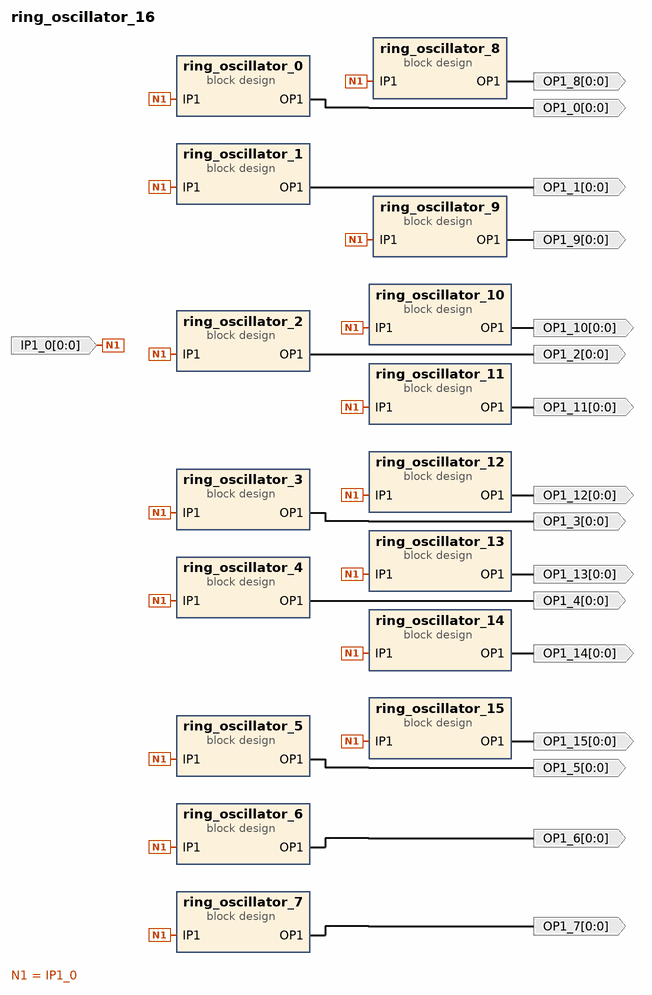
[diagram p0: block diagram of the top level]
# Vivado block design ring_oscillator_16, xc7z020clg400-1, Vivado 2021.1
create_bd_design ring_oscillator_16

create_bd_port -dir I -from 0 -to 0 IP1_0
create_bd_port -dir O -from 0 -to 0 OP1_0
create_bd_port -dir O -from 0 -to 0 OP1_1
create_bd_port -dir O -from 0 -to 0 OP1_2
create_bd_port -dir O -from 0 -to 0 OP1_3
create_bd_port -dir O -from 0 -to 0 OP1_4
create_bd_port -dir O -from 0 -to 0 OP1_5
create_bd_port -dir O -from 0 -to 0 OP1_6
create_bd_port -dir O -from 0 -to 0 OP1_7
create_bd_port -dir O -from 0 -to 0 OP1_8
create_bd_port -dir O -from 0 -to 0 OP1_9
create_bd_port -dir O -from 0 -to 0 OP1_10
create_bd_port -dir O -from 0 -to 0 OP1_11
create_bd_port -dir O -from 0 -to 0 OP1_12
create_bd_port -dir O -from 0 -to 0 OP1_13
create_bd_port -dir O -from 0 -to 0 OP1_14
create_bd_port -dir O -from 0 -to 0 OP1_15

create_bd_cell -type container -reference ring_oscillator ring_oscillator_0
set_property -dict [list \
  CONFIG.ACTIVE_SIM_BD ring_oscillator.bd \
  CONFIG.ACTIVE_SYNTH_BD ring_oscillator.bd \
  CONFIG.ENABLE_DFX 0 \
  CONFIG.LIST_SIM_BD ring_oscillator.bd \
  CONFIG.LIST_SYNTH_BD ring_oscillator.bd \
  CONFIG.LOCK_PROPAGATE 0 \
] [get_bd_cells ring_oscillator_0]
create_bd_cell -type container -reference ring_oscillator ring_oscillator_1
set_property -dict [list \
  CONFIG.ACTIVE_SIM_BD ring_oscillator.bd \
  CONFIG.ACTIVE_SYNTH_BD ring_oscillator.bd \
  CONFIG.ENABLE_DFX 0 \
  CONFIG.LIST_SIM_BD ring_oscillator.bd \
  CONFIG.LIST_SYNTH_BD ring_oscillator.bd \
  CONFIG.LOCK_PROPAGATE 0 \
] [get_bd_cells ring_oscillator_1]
create_bd_cell -type container -reference ring_oscillator ring_oscillator_2
set_property -dict [list \
  CONFIG.ACTIVE_SIM_BD ring_oscillator.bd \
  CONFIG.ACTIVE_SYNTH_BD ring_oscillator.bd \
  CONFIG.ENABLE_DFX 0 \
  CONFIG.LIST_SIM_BD ring_oscillator.bd \
  CONFIG.LIST_SYNTH_BD ring_oscillator.bd \
  CONFIG.LOCK_PROPAGATE 0 \
] [get_bd_cells ring_oscillator_2]
create_bd_cell -type container -reference ring_oscillator ring_oscillator_3
set_property -dict [list \
  CONFIG.ACTIVE_SIM_BD ring_oscillator.bd \
  CONFIG.ACTIVE_SYNTH_BD ring_oscillator.bd \
  CONFIG.ENABLE_DFX 0 \
  CONFIG.LIST_SIM_BD ring_oscillator.bd \
  CONFIG.LIST_SYNTH_BD ring_oscillator.bd \
  CONFIG.LOCK_PROPAGATE 0 \
] [get_bd_cells ring_oscillator_3]
create_bd_cell -type container -reference ring_oscillator ring_oscillator_4
set_property -dict [list \
  CONFIG.ACTIVE_SIM_BD ring_oscillator.bd \
  CONFIG.ACTIVE_SYNTH_BD ring_oscillator.bd \
  CONFIG.ENABLE_DFX 0 \
  CONFIG.LIST_SIM_BD ring_oscillator.bd \
  CONFIG.LIST_SYNTH_BD ring_oscillator.bd \
  CONFIG.LOCK_PROPAGATE 0 \
] [get_bd_cells ring_oscillator_4]
create_bd_cell -type container -reference ring_oscillator ring_oscillator_5
set_property -dict [list \
  CONFIG.ACTIVE_SIM_BD ring_oscillator.bd \
  CONFIG.ACTIVE_SYNTH_BD ring_oscillator.bd \
  CONFIG.ENABLE_DFX 0 \
  CONFIG.LIST_SIM_BD ring_oscillator.bd \
  CONFIG.LIST_SYNTH_BD ring_oscillator.bd \
  CONFIG.LOCK_PROPAGATE 0 \
] [get_bd_cells ring_oscillator_5]
create_bd_cell -type container -reference ring_oscillator ring_oscillator_6
set_property -dict [list \
  CONFIG.ACTIVE_SIM_BD ring_oscillator.bd \
  CONFIG.ACTIVE_SYNTH_BD ring_oscillator.bd \
  CONFIG.ENABLE_DFX 0 \
  CONFIG.LIST_SIM_BD ring_oscillator.bd \
  CONFIG.LIST_SYNTH_BD ring_oscillator.bd \
  CONFIG.LOCK_PROPAGATE 0 \
] [get_bd_cells ring_oscillator_6]
create_bd_cell -type container -reference ring_oscillator ring_oscillator_7
set_property -dict [list \
  CONFIG.ACTIVE_SIM_BD ring_oscillator.bd \
  CONFIG.ACTIVE_SYNTH_BD ring_oscillator.bd \
  CONFIG.ENABLE_DFX 0 \
  CONFIG.LIST_SIM_BD ring_oscillator.bd \
  CONFIG.LIST_SYNTH_BD ring_oscillator.bd \
  CONFIG.LOCK_PROPAGATE 0 \
] [get_bd_cells ring_oscillator_7]
create_bd_cell -type container -reference ring_oscillator ring_oscillator_8
set_property -dict [list \
  CONFIG.ACTIVE_SIM_BD ring_oscillator.bd \
  CONFIG.ACTIVE_SYNTH_BD ring_oscillator.bd \
  CONFIG.ENABLE_DFX 0 \
  CONFIG.LIST_SIM_BD ring_oscillator.bd \
  CONFIG.LIST_SYNTH_BD ring_oscillator.bd \
  CONFIG.LOCK_PROPAGATE 0 \
] [get_bd_cells ring_oscillator_8]
create_bd_cell -type container -reference ring_oscillator ring_oscillator_9
set_property -dict [list \
  CONFIG.ACTIVE_SIM_BD ring_oscillator.bd \
  CONFIG.ACTIVE_SYNTH_BD ring_oscillator.bd \
  CONFIG.ENABLE_DFX 0 \
  CONFIG.LIST_SIM_BD ring_oscillator.bd \
  CONFIG.LIST_SYNTH_BD ring_oscillator.bd \
  CONFIG.LOCK_PROPAGATE 0 \
] [get_bd_cells ring_oscillator_9]
create_bd_cell -type container -reference ring_oscillator ring_oscillator_10
set_property -dict [list \
  CONFIG.ACTIVE_SIM_BD ring_oscillator.bd \
  CONFIG.ACTIVE_SYNTH_BD ring_oscillator.bd \
  CONFIG.ENABLE_DFX 0 \
  CONFIG.LIST_SIM_BD ring_oscillator.bd \
  CONFIG.LIST_SYNTH_BD ring_oscillator.bd \
  CONFIG.LOCK_PROPAGATE 0 \
] [get_bd_cells ring_oscillator_10]
create_bd_cell -type container -reference ring_oscillator ring_oscillator_11
set_property -dict [list \
  CONFIG.ACTIVE_SIM_BD ring_oscillator.bd \
  CONFIG.ACTIVE_SYNTH_BD ring_oscillator.bd \
  CONFIG.ENABLE_DFX 0 \
  CONFIG.LIST_SIM_BD ring_oscillator.bd \
  CONFIG.LIST_SYNTH_BD ring_oscillator.bd \
  CONFIG.LOCK_PROPAGATE 0 \
] [get_bd_cells ring_oscillator_11]
create_bd_cell -type container -reference ring_oscillator ring_oscillator_12
set_property -dict [list \
  CONFIG.ACTIVE_SIM_BD ring_oscillator.bd \
  CONFIG.ACTIVE_SYNTH_BD ring_oscillator.bd \
  CONFIG.ENABLE_DFX 0 \
  CONFIG.LIST_SIM_BD ring_oscillator.bd \
  CONFIG.LIST_SYNTH_BD ring_oscillator.bd \
  CONFIG.LOCK_PROPAGATE 0 \
] [get_bd_cells ring_oscillator_12]
create_bd_cell -type container -reference ring_oscillator ring_oscillator_13
set_property -dict [list \
  CONFIG.ACTIVE_SIM_BD ring_oscillator.bd \
  CONFIG.ACTIVE_SYNTH_BD ring_oscillator.bd \
  CONFIG.ENABLE_DFX 0 \
  CONFIG.LIST_SIM_BD ring_oscillator.bd \
  CONFIG.LIST_SYNTH_BD ring_oscillator.bd \
  CONFIG.LOCK_PROPAGATE 0 \
] [get_bd_cells ring_oscillator_13]
create_bd_cell -type container -reference ring_oscillator ring_oscillator_14
set_property -dict [list \
  CONFIG.ACTIVE_SIM_BD ring_oscillator.bd \
  CONFIG.ACTIVE_SYNTH_BD ring_oscillator.bd \
  CONFIG.ENABLE_DFX 0 \
  CONFIG.LIST_SIM_BD ring_oscillator.bd \
  CONFIG.LIST_SYNTH_BD ring_oscillator.bd \
  CONFIG.LOCK_PROPAGATE 0 \
] [get_bd_cells ring_oscillator_14]
create_bd_cell -type container -reference ring_oscillator ring_oscillator_15
set_property -dict [list \
  CONFIG.ACTIVE_SIM_BD ring_oscillator.bd \
  CONFIG.ACTIVE_SYNTH_BD ring_oscillator.bd \
  CONFIG.ENABLE_DFX 0 \
  CONFIG.LIST_SIM_BD ring_oscillator.bd \
  CONFIG.LIST_SYNTH_BD ring_oscillator.bd \
  CONFIG.LOCK_PROPAGATE 0 \
] [get_bd_cells ring_oscillator_15]

# ---- connections ----

connect_bd_net -net IP1_0_1 [get_bd_ports IP1_0] \
  [get_bd_pins ring_oscillator_15/IP1] [get_bd_pins ring_oscillator_11/IP1] [get_bd_pins ring_oscillator_12/IP1] \
  [get_bd_pins ring_oscillator_13/IP1] [get_bd_pins ring_oscillator_14/IP1] [get_bd_pins ring_oscillator_0/IP1] \
  [get_bd_pins ring_oscillator_1/IP1] [get_bd_pins ring_oscillator_2/IP1] [get_bd_pins ring_oscillator_3/IP1] \
  [get_bd_pins ring_oscillator_4/IP1] [get_bd_pins ring_oscillator_5/IP1] [get_bd_pins ring_oscillator_6/IP1] \
  [get_bd_pins ring_oscillator_7/IP1] [get_bd_pins ring_oscillator_8/IP1] [get_bd_pins ring_oscillator_9/IP1] \
  [get_bd_pins ring_oscillator_10/IP1]
connect_bd_net [get_bd_pins ring_oscillator_0/OP1] [get_bd_ports OP1_0]
connect_bd_net [get_bd_pins ring_oscillator_10/OP1] [get_bd_ports OP1_10]
connect_bd_net [get_bd_pins ring_oscillator_11/OP1] [get_bd_ports OP1_11]
connect_bd_net [get_bd_pins ring_oscillator_12/OP1] [get_bd_ports OP1_12]
connect_bd_net [get_bd_pins ring_oscillator_13/OP1] [get_bd_ports OP1_13]
connect_bd_net [get_bd_pins ring_oscillator_14/OP1] [get_bd_ports OP1_14]
connect_bd_net [get_bd_pins ring_oscillator_15/OP1] [get_bd_ports OP1_15]
connect_bd_net [get_bd_pins ring_oscillator_1/OP1] [get_bd_ports OP1_1]
connect_bd_net [get_bd_pins ring_oscillator_2/OP1] [get_bd_ports OP1_2]
connect_bd_net [get_bd_pins ring_oscillator_3/OP1] [get_bd_ports OP1_3]
connect_bd_net [get_bd_pins ring_oscillator_4/OP1] [get_bd_ports OP1_4]
connect_bd_net [get_bd_pins ring_oscillator_5/OP1] [get_bd_ports OP1_5]
connect_bd_net [get_bd_pins ring_oscillator_6/OP1] [get_bd_ports OP1_6]
connect_bd_net [get_bd_pins ring_oscillator_7/OP1] [get_bd_ports OP1_7]
connect_bd_net [get_bd_pins ring_oscillator_8/OP1] [get_bd_ports OP1_8]
connect_bd_net [get_bd_pins ring_oscillator_9/OP1] [get_bd_ports OP1_9]

validate_bd_design
save_bd_design
